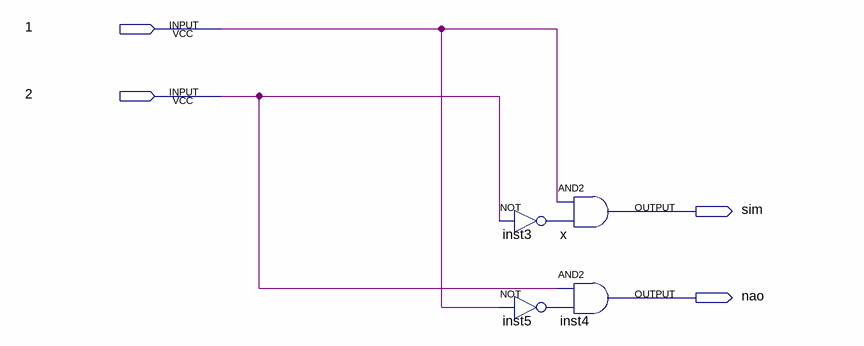
[diagram p0: schematic sheet]
// Quartus schematic decodificadorSinalMaiorMenor.bdf as structural Verilog: 4 symbols, 4 pins
module decodificadorSinalMaiorMenor (
  input  \1 ,
  input  \2 ,
  output sim,
  output nao
);

  wire inst3_out, inst5_out;

  not inst3 (inst3_out, \2 );
  not inst5 (inst5_out, \1 );
  and x (sim, \1 , inst3_out);
  and inst4 (nao, \2 , inst5_out);
endmodule
